# EAGLE design Controllboard (EAGLE 9.1.1)
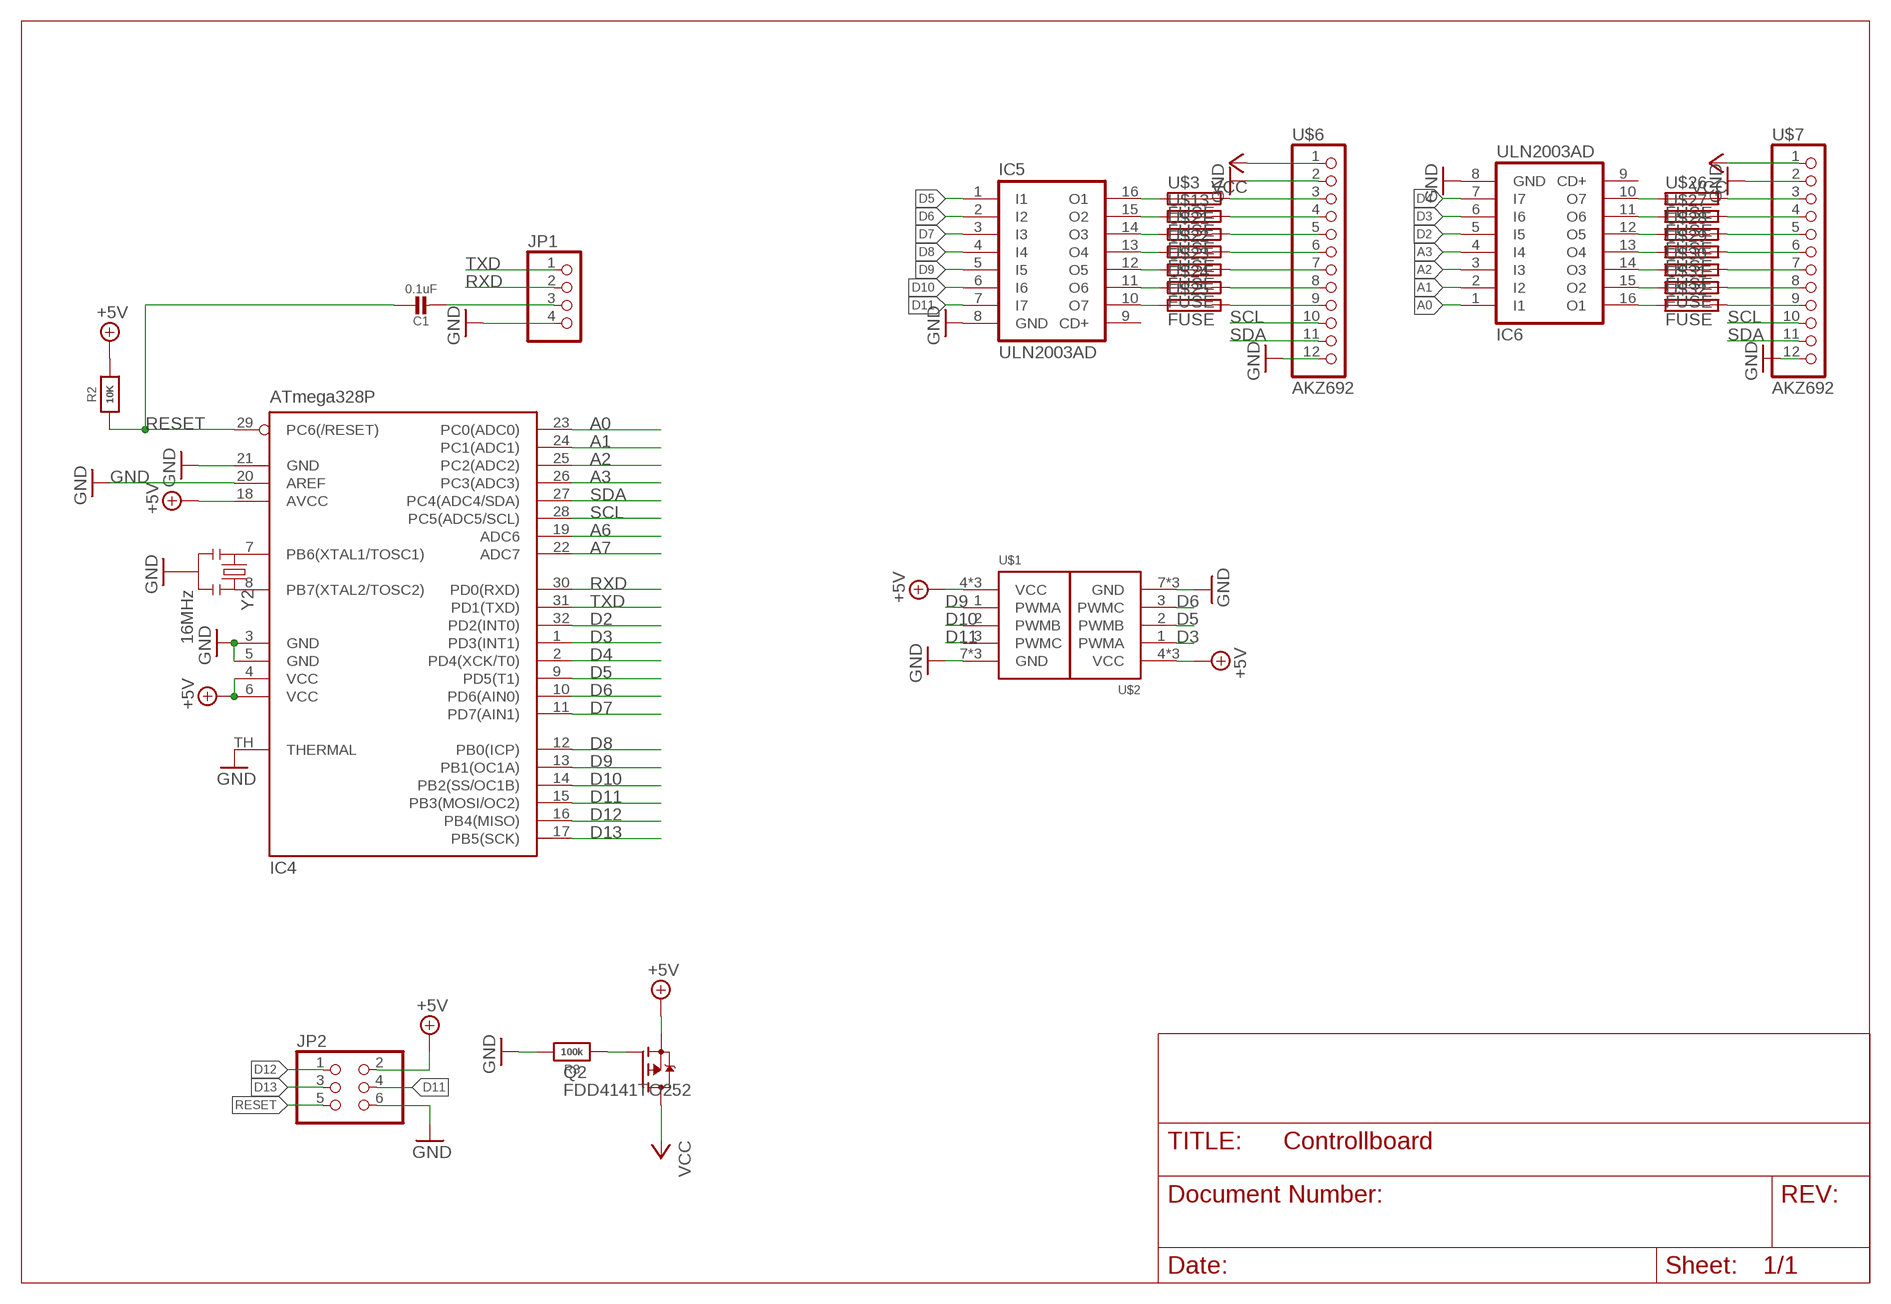
[diagram p0: schematic, sheet 1]

## Parts
C1  0.1uF  CAP_CERAMIC0805-NOOUTLINE  [0805-NO]
IC4  ATmega328P  MEGA8-MI  [MLF32-TH]
IC5  ULN2003AD  [SO16]
IC6  ULN2003AD  [SO16]
JP1  PINHD-1X4  [1X04]
JP2  PINHD-2X3M  [2X03M]
Q2  FDD4141TO252  [TO252]
R2  10K  RESISTOR0805_NOOUTLINE  [0805-NO]
R3  100k  RESISTOR0805_NOOUTLINE  [0805-NO]
U$1  SERVO_X3  [2X03/90]
U$2  SERVO_X3  [2X03/90]
U$3  FUSE  [C1206]
U$6  AKZ692  [1X12]
U$7  AKZ692  [1X12]
U$13  FUSE  [C1206]
U$21  FUSE  [C1206]
U$22  FUSE  [C1206]
U$23  FUSE  [C1206]
U$24  FUSE  [C1206]
U$25  FUSE  [C1206]
U$26  FUSE  [C1206]
U$27  FUSE  [C1206]
U$28  FUSE  [C1206]
U$29  FUSE  [C1206]
U$30  FUSE  [C1206]
U$31  FUSE  [C1206]
U$32  FUSE  [C1206]
Y2  16MHz  RESONATORSMD  [RESONATOR-SMD]

## Nets
+5V: IC4.4(VCC) IC4.6(VCC) IC4.18(AVCC) JP2.2 Q2.2(S) R2.2 U$1.4(VCC) U$1.5(VCC) U$1.6(VCC) U$2.4(VCC) U$2.5(VCC) U$2.6(VCC)
A0: IC4.23(PC0(ADC0)) IC6.1(I1)
A1: IC4.24(PC1(ADC1)) IC6.2(I2)
A2: IC4.25(PC2(ADC2)) IC6.3(I3)
A3: IC4.26(PC3(ADC3)) IC6.4(I4)
A6: IC4.19(ADC6)
A7: IC4.22(ADC7)
D2: IC4.32(PD2(INT0)) IC6.5(I5)
D3: IC4.1(PD3(INT1)) IC6.6(I6) U$2.1(PWMA)
D4: IC4.2(PD4(XCK/T0)) IC6.7(I7)
D5: IC4.9(PD5(T1)) IC5.1(I1) U$2.2(PWMB)
D6: IC4.10(PD6(AIN0)) IC5.2(I2) U$2.3(PWMC)
D7: IC4.11(PD7(AIN1)) IC5.3(I3)
D8: IC4.12(PB0(ICP)) IC5.4(I4)
D9: IC4.13(PB1(OC1A)) IC5.5(I5) U$1.1(PWMA)
D10: IC4.14(PB2(SS/OC1B)) IC5.6(I6) U$1.2(PWMB)
D11: IC4.15(PB3(MOSI/OC2)) IC5.7(I7) JP2.4 U$1.3(PWMC)
D12: IC4.16(PB4(MISO)) JP2.1
D13: IC4.17(PB5(SCK)) JP2.3
DTR/RTS1: C1.2 JP1.3
GND [power]: IC4.3(GND) IC4.5(GND) IC4.20(AREF) IC4.21(GND) IC4.TH(THERMAL) IC5.8(GND) IC6.8(GND) JP1.4 JP2.6 R3.2 U$1.7(GND) U$1.8(GND) U$1.9(GND) U$2.7(GND) U$2.8(GND) U$2.9(GND) U$6.2 U$6.12 U$7.2 U$7.12 Y2.2
N$7: IC4.8(PB7(XTAL2/TOSC2)) Y2.3
N$8: IC4.7(PB6(XTAL1/TOSC1)) Y2.1
N$12: U$3.2 U$6.3
N$35: U$6.4 U$13.2
N$36: U$6.5 U$21.2
N$37: U$6.6 U$22.2
N$38: U$6.7 U$23.2
N$39: U$6.8 U$24.2
N$40: U$6.9 U$25.2
N$41: U$7.3 U$26.2
N$42: U$7.4 U$27.2
N$43: U$7.5 U$28.2
N$44: U$7.6 U$29.2
N$45: U$7.7 U$30.2
N$46: U$7.8 U$31.2
N$47: U$7.9 U$32.2
N$48: IC5.16(O1) U$3.1
N$49: IC5.15(O2) U$13.1
N$50: IC5.14(O3) U$21.1
N$51: IC5.13(O4) U$22.1
N$52: IC5.12(O5) U$23.1
N$53: IC5.11(O6) U$24.1
N$54: IC5.10(O7) U$25.1
N$55: IC6.10(O7) U$26.1
N$56: IC6.11(O6) U$27.1
N$57: IC6.12(O5) U$28.1
N$58: IC6.13(O4) U$29.1
N$59: IC6.14(O3) U$30.1
N$60: IC6.15(O2) U$31.1
N$61: IC6.16(O1) U$32.1
N$62: Q2.1(G) R3.1
RESET: C1.1 IC4.29(PC6(/RESET)) JP2.5 R2.1
RXD: IC4.30(PD0(RXD)) JP1.2
SCL: IC4.28(PC5(ADC5/SCL)) U$6.10 U$7.10
SDA: IC4.27(PC4(ADC4/SDA)) U$6.11 U$7.11
TXD: IC4.31(PD1(TXD)) JP1.1
VCC: Q2.3(D) U$6.1 U$7.1
Unconnected: IC5.9(CD+) IC6.9(CD+)

## Library data of the parts
C1 = microbuilder:CAP_CERAMIC: Ceramic Capacitors For new designs, use the packages preceded by an '_' character since they are more reliable: The following footprints should be used on most boards: _0402 - Standard footprint for regular board layouts _0603 - Standard footprint for regular board layouts _0805 - Standard footprint for regular board layouts _1206 - Standard footprint for regular board layouts For extremely tight-pitch boards where space is at a premium, the following 'micro-pitch' footprints can be used (smaller pads, no silkscreen outline, etc.): _0402MP - Micro-pitch footprint for very dense/compact boards _0603MP - Micro-pitch footprint for very dense/compact boards _0805MP - Micro-pitch footprint for very dense/compact boards _1206MP - Micro-pitch footprint for very dense/compact boards
IC4 = microbuilder:MEGA8-MI: MICROCONTROLLER 8 Kbytes FLASH, 1 kbytes SRAM, 512 bytes EEPROM, USART, 6-channel 10 bit ADC, 2-channel 8 bit ADC Pin compatible with Atmega48, ATMega88, ATMega168 Source: avr.lbr; MPN: ATMEGA88PA-MU; OC_FARNELL: 1715491; OC_NEWARK: 15R0272
IC5 IC6 = uln-udn:ULN2003A: DRIVER ARRAY
JP1 = pinhead:PINHD-1X4: PIN HEADER
JP2 = pinhead:PINHD-2X3: PIN HEADER
Q2 = transistor-fet:FDD4141: P-Channel PowerTrench® MOSFET Source: FDD4141.pdf
R2 R3 = microbuilder:RESISTOR: Resistors For new designs, use the packages preceded by an '_' character since they are more reliable: The following footprints should be used on most boards: _0402 - Standard footprint for regular board layouts _0603 - Standard footprint for regular board layouts _0805 - Standard footprint for regular board layouts _1206 - Standard footprint for regular board layouts For extremely tight-pitch boards where space is at a premium, the following 'micro-pitch' footprints can be used (smaller pads, no silkscreen outline, etc.): _0402MP - Micro-pitch footprint for very dense/compact boards _0603MP - Micro-pitch footprint for very dense/compact boards _0805MP - Micro-pitch footprint for very dense/compact boards _1206MP - Micro-pitch footprint for very dense/compact boards
U$1 U$2 = HeRo:SERVO_X3
U$3 U$13 U$21-U$32 = HeRo:FUSE
U$6 U$7 = HeRo:AKZ692
Y2 = SparkFun:RESONATOR: Resonator Small SMD resonator. This is the itty bitty 10/20MHz resonators with built in caps. CSTCE10M0G55 and CSTCE20M0V53. Footprint has been reviewed closely but hasn't been tested yet.

## Net classes
1 power: width 0.305 mm

## Board
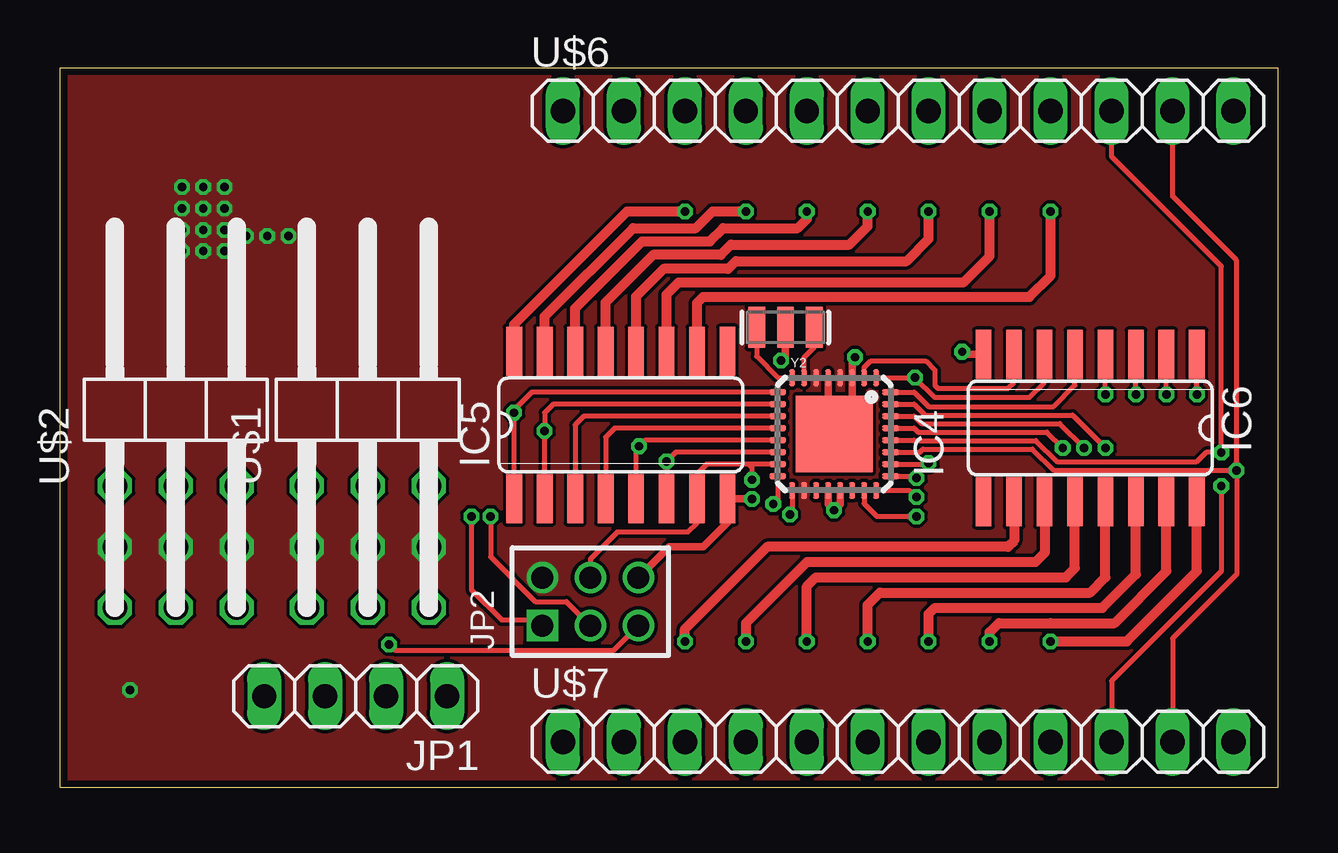
[diagram p1: board, top side]
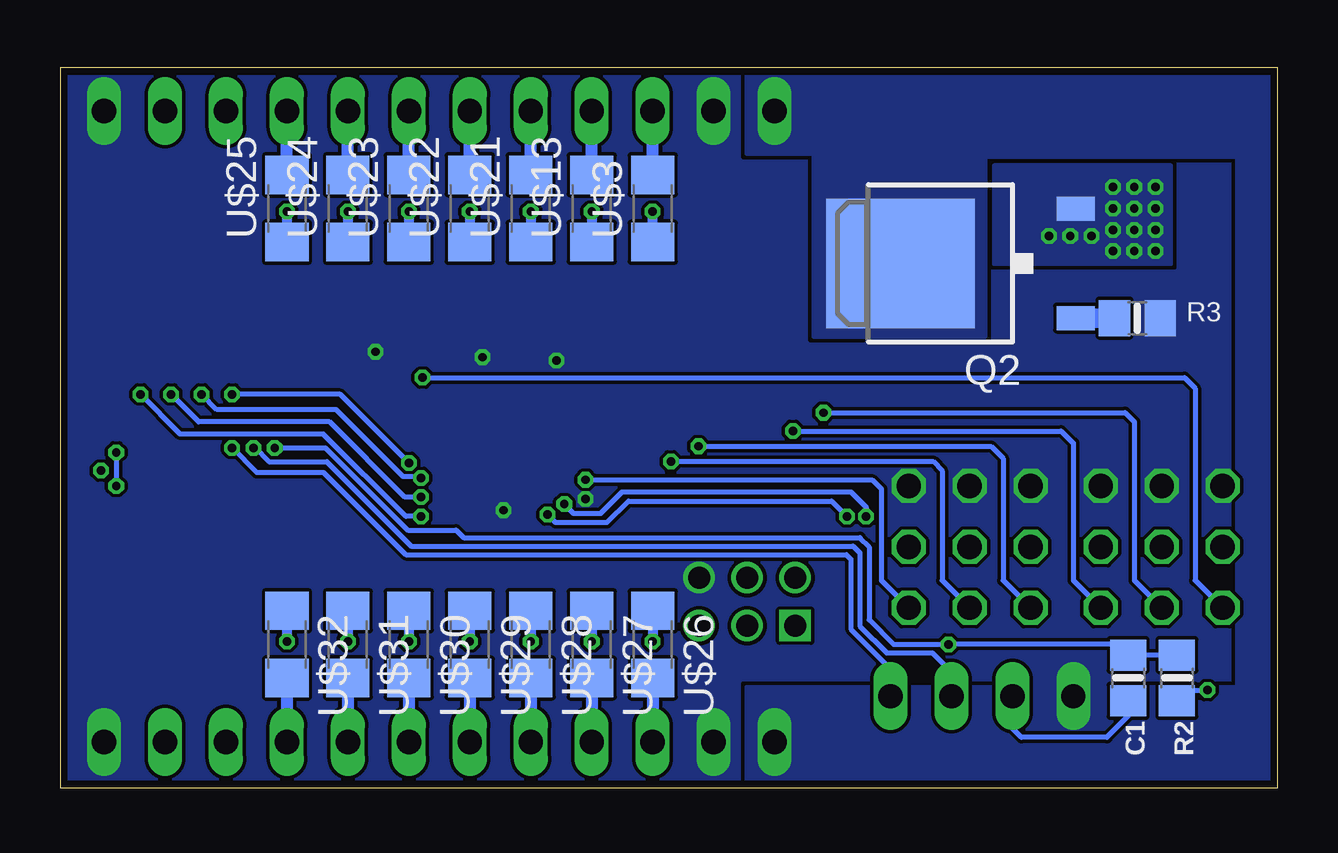
[diagram p2: board, bottom side, seen from below]

Size 50.73 x 30 mm. Coordinates in mm from the lower left corner, seen from the top.
Outline: 0,0 0,30 50.73,30 50.73,0 0,0
Copper layers (1*16): Top 0.035mm / dielectric 1.5mm / Bottom 0.035mm
Design rules "PCB-POOL Standard": minimum track width 0.15mm, minimum drill 0.3mm, track to track 0.15mm, track to pad 0.15mm, pad to pad 0.15mm, via to via 0.15mm, smd to smd 0.15mm, copper to edge 0.3mm, drill to drill 0.2mm, minimum pad ring 0.2mm, minimum via ring 0.15mm, stop-mask expansion 0.075mm, vias tented up to drill 0mil, thermal gap 0.2mm

### Footprints (pad centres in the part's own frame; a part is rotated, then mirrored left to right if it is on the bottom)
0805-NO = smd 1.3 x 1.5: 1 -0.95,0; 2 0.95,0
MLF32-TH = smd 0.7 x 0.25: 1 -2.35,1.75; 2 -2.35,1.25; 3 -2.35,0.75; 4 -2.35,0.25; 5 -2.35,-0.25; 6 -2.35,-0.75; 7 -2.35,-1.25; 8 -2.35,-1.75; 17 2.35,-1.75; 18 2.35,-1.25; 19 2.35,-0.75; 20 2.35,-0.25; 21 2.35,0.25; 22 2.35,0.75; 23 2.35,1.25; 24 2.35,1.75 | smd 0.25 x 0.7: 9 -1.75,-2.35; 10 -1.25,-2.35; 11 -0.75,-2.35; 12 -0.25,-2.35; 13 0.25,-2.35; 14 0.75,-2.35; 15 1.25,-2.35; 16 1.75,-2.35; 25 1.75,2.35; 26 1.25,2.35; 27 0.75,2.35; 28 0.25,2.35; 29 -0.25,2.35; 30 -0.75,2.35; 31 -1.25,2.35; 32 -1.75,2.35 | smd 3.2 x 3.2: TH 0,0
SO16 = smd 0.66 x 2.032: 1 -4.445,-3.073; 2 -3.175,-3.073; 3 -1.905,-3.073; 4 -0.635,-3.073; 5 0.635,-3.073; 6 1.905,-3.073; 7 3.175,-3.073; 8 4.445,-3.073; 9 4.445,3.073; 10 3.175,3.073; 11 1.905,3.073; 12 0.635,3.073; 13 -0.635,3.073; 14 -1.905,3.073; 15 -3.175,3.073; 16 -4.445,3.073
1X04 = drill 1.016 long: 1 -3.81,0; 2 -1.27,0; 3 1.27,0; 4 3.81,0
2X03M = drill 0.914 square: 1 -2,-1 | drill 0.914: 2 -2,1; 3 0,-1; 4 0,1; 5 2,-1; 6 2,1
TO252 = smd 1 x 1.6: 1 -2.28,-4.8; 2 2.28,-4.8 | smd 5.4 x 6.2: 3 0,2.5
2X03/90 = drill 1.016 octagon: 1 -2.54,-8.89; 2 0,-8.89; 3 2.54,-8.89; 4 -2.54,-6.35; 5 0,-6.35; 6 2.54,-6.35; 7 -2.54,-3.81; 8 2.54,-3.81; 9 0,-3.81
C1206 = smd 1.6 x 1.8: 1 -1.4,0; 2 1.4,0
1X12 = drill 1.016 long: 1 -13.97,0; 2 -11.43,0; 3 -8.89,0; 4 -6.35,0; 5 -3.81,0; 6 -1.27,0; 7 1.27,0; 8 3.81,0; 9 6.35,0; 10 8.89,0; 11 11.43,0; 12 13.97,0
RESONATOR-SMD = smd 0.7 x 1.7: 1 -1.2,0; 2 0,0; 3 1.2,0

### Placement (x,y rotation side)
C1  6.22,4.57 270 bottom
IC4  32.26,14.73 270 top
IC5  23.37,15.11 0 top
IC6  42.93,14.99 180 top
JP1  12.32,3.81 180 top
JP2  22.1,7.75 0 top
Q2  13.21,21.84 90 bottom
R2  4.19,4.57 270 bottom
R3  5.84,19.56 0 bottom
U$1  12.83,16.38 0 top
U$2  4.83,16.38 0 top
U$3  26.04,24.13 90 bottom
U$6  34.92,28.19 0 top
U$7  34.92,1.91 0 top
U$13  28.57,24.13 90 bottom
U$21  31.11,24.13 90 bottom
U$22  33.66,24.13 90 bottom
U$23  36.2,24.13 90 bottom
U$24  38.73,24.13 90 bottom
U$25  41.27,24.13 90 bottom
U$26  26.04,5.97 270 bottom
U$27  28.57,5.97 270 bottom
U$28  31.11,5.97 270 bottom
U$29  33.66,5.97 270 bottom
U$30  36.2,5.97 270 bottom
U$31  38.73,5.97 270 bottom
U$32  41.27,5.97 270 bottom
Y2  30.23,19.18 180 top

### Tracks (layer width: path | path; a pad name or v marks a point on that pad's centre or on a via)
+5V  (via drill 0.35)
  Bottom 0.203: v2.92,4.06 3.75,4.06 R2.2
  other vias: 5.08,25.02 5.97,25.02 6.86,25.02 5.08,24.13 5.97,24.13 6.86,24.13 5.08,23.24 5.97,23.24 6.86,23.24 5.08,22.35 5.97,22.35 6.86,22.35 7.75,22.99 8.64,22.99 9.53,22.99
  pour Top (rank 2, no thermals): -3.17,32.38 -3.17,-1.65 59.31,-1.65 59.31,32.38
  pour Bottom (no thermals): 4.45,25.91 11.81,25.91 11.81,21.84 4.45,21.84
A0  (via drill 0.35)
  Top 0.203: IC4.23 33.51,11.83 34.04,11.3 v35.69,11.3 | v47.37,16.38 IC6.1
  Bottom 0.203: v35.69,11.3 36.32,11.3 39.75,14.73 45.72,14.73 v47.37,16.38
A1  (via drill 0.35)
  Top 0.203: v46.1,16.38 IC6.2 | IC4.24 35.4,12.38 35.45,12.33 35.46,12.33 v35.69,12.11
  Bottom 0.203: v35.69,12.11 36.36,12.11 39.5,15.24 44.96,15.24 v46.1,16.38
A2  (via drill 0.35)
  Top 0.203: IC4.25 35.61,12.98 v35.69,12.9 | v44.83,16.38 IC6.3
  Bottom 0.203: v35.69,12.9 35.74,12.96 36.43,12.96 39.23,15.75 44.2,15.75 v44.83,16.38
A3  (via drill 0.35)
  Top 0.203: IC4.26 36.15,13.48 v36.2,13.53 | v43.56,16.38 IC6.4
  Bottom 0.203: v36.2,13.53 39.05,16.38 v43.56,16.38
D2
  Top 0.203: IC6.5 42.29,16.76 41.4,15.88 36.2,15.88 35.59,16.48 IC4.32
D3  (via drill 0.35)
  Top 0.203: IC6.6 41.02,16.89 40.39,16.26 36.45,16.26 v35.62,17.08 IC4.1
  Bottom 0.203: U$2.1 3.43,8.64 3.43,16.64 3.87,17.08 v35.62,17.08
D4
  Top 0.203: IC4.2 33.51,17.51 33.78,17.78 36.07,17.78 36.45,17.4 36.45,16.76 36.58,16.64 39.5,16.64 39.75,16.89 IC6.7
D5  (via drill 0.35)
  Top 0.203: IC5.1 v18.92,15.62 18.92,15.75 19.66,16.48 IC4.9
  Bottom 0.203: U$2.2 5.97,8.64 5.97,15.24 6.35,15.62 v18.92,15.62
D6  (via drill 0.35)
  Top 0.203: IC4.10 20.55,15.98 20.19,15.62 v20.19,14.86 IC5.2
  Bottom 0.203: U$2.3 8.51,8.64 8.51,14.35 9.02,14.86 v20.19,14.86
D7
  Top 0.203: IC4.11 21.83,15.48 21.46,15.11 IC5.3
D8
  Top 0.203: IC4.12 23.11,14.98 22.99,14.86 22.73,14.61 IC5.4
D9  (via drill 0.35)
  Top 0.203: IC4.13 24.39,14.48 v24.13,14.22 24,14.1 IC5.5
  Bottom 0.203: U$1.1 11.43,8.64 11.43,13.72 11.94,14.22 v24.13,14.22
D10  (via drill 0.35)
  Top 0.203: IC4.14 25.67,13.98 v25.27,13.59 IC5.6
  Bottom 0.203: U$1.2 13.97,8.64 13.97,13.21 14.35,13.59 v25.27,13.59
D11  (via drill 0.35)
  Top 0.203: 28.7,13.48 26.94,13.48 26.54,13.08 IC5.7 26.54,11.02 26.16,10.64 23.22,10.64 22.1,9.53 JP2.4 | 28.7,13.48 28.83,13.36 v28.83,12.83 | IC4.15 28.7,13.48
  Bottom 0.203: U$1.3 16.51,8.64 16.51,12.45 16.89,12.83 v28.83,12.83
D12  (via drill 0.35)
  Top 0.203: IC4.16 29.91,12 v29.72,11.81 | v17.14,11.3 17.14,8.24 18.4,6.99 19.86,6.99 JP2.1
  Bottom 0.203: v29.72,11.81 29.34,11.43 28.19,11.43 27.3,12.32 17.78,12.32 17.14,11.68 v17.14,11.3
D13  (via drill 0.35)
  Top 0.203: IC4.17 30.51,11.47 v30.41,11.37 | v17.95,11.3 17.95,9.61 19.81,7.75 21.1,7.75 JP2.3
  Bottom 0.203: v30.41,11.37 30.09,11.05 27.94,11.05 27.05,11.94 18.58,11.94 v17.95,11.3
DTR/RTS1
  Bottom 0.203: JP1.3 11.05,2.48 10.67,2.1 7.11,2.1 6.22,2.99 C1.2
GND  (via drill 0.35)
  Top 0.305: IC4.5 32.01,14.98 IC4.TH 33.01,15.48 IC4.3 33.01,17.82 v33.12,17.93 | IC6.8 37.69,18.06 v37.59,18.16 | v30.05,17.8 30.23,17.98 Y2.2 | v28.83,12.03 28.82,12.04 IC5.8 27.81,11.05 26.8,10.03 25.38,10.03 JP2.6 | IC4.20 32.01,11.81 v32.26,11.56 32.51,11.81 IC4.21
  pour Bottom (rank 2, no thermals): -4.57,33.66 -4.57,-1.02 59.94,-1.02 59.94,33.66
N$7
  Top 0.203: Y2.3 29.03,17.96 29.91,17.08 IC4.8
N$8
  Top 0.203: IC4.7 31.01,17.93 31.43,18.34 Y2.1
N$12
  Bottom 0.508: U$3.2 U$6.3
N$35
  Bottom 0.508: U$13.2 U$6.4
N$36
  Bottom 0.508: U$21.2 U$6.5
N$37
  Bottom 0.508: U$22.2 U$6.6
N$38
  Bottom 0.508: U$23.2 U$6.7
N$39
  Bottom 0.508: U$24.2 U$6.8
N$40
  Bottom 0.508: U$25.2 U$6.9
N$41
  Bottom 0.508: U$26.2 U$7.3
N$42
  Bottom 0.508: U$27.2 U$7.4
N$43
  Bottom 0.508: U$28.2 U$7.5
N$44
  Bottom 0.508: U$29.2 U$7.6
N$45
  Bottom 0.508: U$30.2 U$7.7
N$46
  Bottom 0.508: U$31.2 U$7.8
N$47
  Bottom 0.508: U$32.2 U$7.9
N$48  (via drill 0.35)
  Top 0.406: v26.04,24 23.62,24 18.92,19.3 IC5.16
  Bottom 0.406: U$3.1 v26.04,24
N$49  (via drill 0.35)
  Top 0.406: IC5.15 20.19,19.63 23.88,23.32 26.49,23.32 27.18,24 v28.57,24
  Bottom 0.406: v28.57,24 U$13.1
N$50  (via drill 0.35)
  Top 0.406: v31.11,24 31.11,23.69 30.73,23.31 27.63,23.31 27.08,22.76 24.26,22.76 21.46,19.96 IC5.14
  Bottom 0.406: v31.11,24 U$21.1
N$51  (via drill 0.35)
  Top 0.406: v33.66,24 33.66,23.39 32.89,22.62 27.96,22.62 27.53,22.2 24.71,22.2 22.73,20.22 IC5.13
  Bottom 0.406: v33.66,24 U$22.1
N$52  (via drill 0.35)
  Top 0.406: v36.2,24 36.2,22.86 35.28,21.94 28.16,21.94 27.84,21.61 25.15,21.61 24,20.47 IC5.12
  Bottom 0.406: v36.2,24 U$23.1
N$53  (via drill 0.35)
  Top 0.406: v38.73,24 38.73,22.15 37.63,21.04 25.77,21.04 25.27,20.55 IC5.11
  Bottom 0.406: v38.73,24 U$24.1
N$54  (via drill 0.35)
  Top 0.406: v41.27,24 41.27,21.34 40.39,20.45 26.8,20.45 26.54,20.19 IC5.10
  Bottom 0.406: v41.27,24 U$25.1
N$55  (via drill 0.35)
  Top 0.406: v26.04,6.1 26.04,6.6 29.46,10.03 39.5,10.03 39.75,10.29 IC6.10
  Bottom 0.406: U$26.1 v26.04,6.1
N$56  (via drill 0.35)
  Top 0.406: v28.57,6.1 28.57,6.86 31.11,9.4 40.64,9.4 41.02,9.78 IC6.11
  Bottom 0.406: U$27.1 v28.57,6.1
N$57  (via drill 0.35)
  Top 0.406: v31.11,6.1 31.11,8.38 31.5,8.76 41.91,8.76 42.29,9.14 IC6.12
  Bottom 0.406: U$28.1 v31.11,6.1
N$58  (via drill 0.35)
  Top 0.406: v33.66,6.1 33.66,7.62 34.16,8.13 42.93,8.13 43.56,8.76 IC6.13
  Bottom 0.406: U$29.1 v33.66,6.1
N$59  (via drill 0.35)
  Top 0.406: v36.2,6.1 36.2,7.24 36.45,7.49 43.43,7.49 44.83,8.89 IC6.14
  Bottom 0.406: U$30.1 v36.2,6.1
N$60  (via drill 0.35)
  Top 0.406: v38.73,6.1 38.73,6.48 39.12,6.86 41.27,6.86 43.94,6.86 46.1,9.02 IC6.15
  Bottom 0.406: U$31.1 v38.73,6.1
N$61  (via drill 0.35)
  Top 0.406: IC6.16 47.37,9.02 44.45,6.1 v41.27,6.1
  Bottom 0.406: U$32.1 v41.27,6.1
N$62
  Bottom 0.813: R3.1 Q2.1
RESET  (via drill 0.35)
  Top 0.203: IC4.29 35.59,14.98 35.76,14.81 41.12,14.81 v41.78,14.15 | JP2.5 23.07,5.71 13.97,5.71 v13.72,5.97
  Bottom 0.203: v41.78,14.15 39.67,14.15 36.24,10.73 34.22,10.73 33.91,10.41 17.4,10.41 17.02,10.03 17.02,6.99 16,5.97 15.66,5.97 v13.72,5.97 6.67,5.97 C1.1 R2.1
RXD  (via drill 0.35)
  Top 0.203: IC4.30 35.59,15.48 35.9,15.17 41.66,15.17 v42.67,14.15
  Bottom 0.203: v42.67,14.15 42.6,14.15 42.02,13.58 39.61,13.58 36.1,10.06 17.68,10.06 17.4,9.78 17.4,6.73 16.28,5.62 14.38,5.62 13.59,4.83 JP1.2
SCL  (via drill 0.35)
  Top 0.203: IC4.28 35.59,14.48 35.61,14.46 40.66,14.46 41.54,13.58 47.36,13.58 47.75,13.97 v48.39,13.97 48.39,21.72 43.81,26.29 U$6.10 | v48.39,12.57 48.39,9.02 43.81,4.45 U$7.10
  Bottom 0.203: v48.39,13.97 v48.39,12.57
SDA  (via drill 0.35)
  Top 0.203: IC4.27 35.83,13.98 35.96,14.11 40.51,14.11 41.4,13.23 49.04,13.23 v49.02,13.21 | v49.02,13.21 49.02,8.89 46.35,6.22 U$7.11 | v49.02,13.21 49.02,21.97 46.35,24.64 U$6.11
TXD  (via drill 0.35)
  Top 0.203: IC4.31 35.59,15.98 36.05,15.52 42.2,15.52 v43.56,14.15
  Bottom 0.203: JP1.1 16.13,4.95 17.72,6.54 17.78,6.6 17.78,9.53 17.96,9.71 36.32,9.71 39.75,13.14 42.55,13.14 v43.56,14.15
VCC
  pour Bottom (no thermals): 18.92,0 22.1,0 22.1,4.19 1.65,4.19 1.65,26.29 12.19,26.29 12.19,18.8 19.3,18.8 19.3,26.42 22.1,26.42 22.1,29.97 0,29.97 0,0